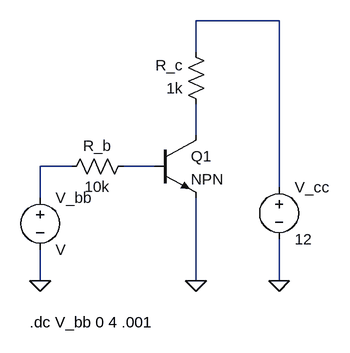
[diagram p0: schematic Draft1.asc]
Draft1.asc, the LTspice schematic file:
Version 4.1
SHEET 1 880 680
WIRE 368 -32 240 -32
WIRE 240 16 240 -32
WIRE 240 144 240 96
WIRE 48 192 0 192
WIRE 176 192 128 192
WIRE 368 224 368 -32
WIRE 0 240 0 192
WIRE 0 368 0 320
WIRE 240 368 240 240
WIRE 368 368 368 304
FLAG 0 368 0
FLAG 240 368 0
FLAG 368 368 0
SYMBOL npn 176 144 R0
SYMATTR InstName Q1
SYMBOL voltage 0 224 R0
SYMATTR InstName V_bb
SYMBOL res 144 176 R90
WINDOW 0 0 56 VBottom 2
WINDOW 3 32 56 VTop 2
SYMATTR InstName R_b
SYMATTR Value 10k
SYMBOL res 256 112 R180
WINDOW 0 36 76 Left 2
WINDOW 3 36 40 Left 2
SYMATTR InstName R_c
SYMATTR Value 1k
SYMBOL voltage 368 208 R0
WINDOW 123 0 0 Left 0
WINDOW 39 0 0 Left 0
SYMATTR InstName V_cc
SYMATTR Value 12
TEXT -16 432 Left 2 !.dc V_bb 0 4 .001

The netlist it stands for:
* Draft1.asc
Q1 N002 N004 0 0 NPN
V_bb N003 0 V
R_b N004 N003 10k
R_c N002 N001 1k
V_cc N001 0 12
.model NPN NPN
.model PNP PNP
.lib standard.bjt
.dc V_bb 0 4 .001
.backanno
.end